# Altium schematic sheet 2.4G_Telecontrol_Board_2020-04-17_STM32RBT6.schdoc
size 408 x 508 mm
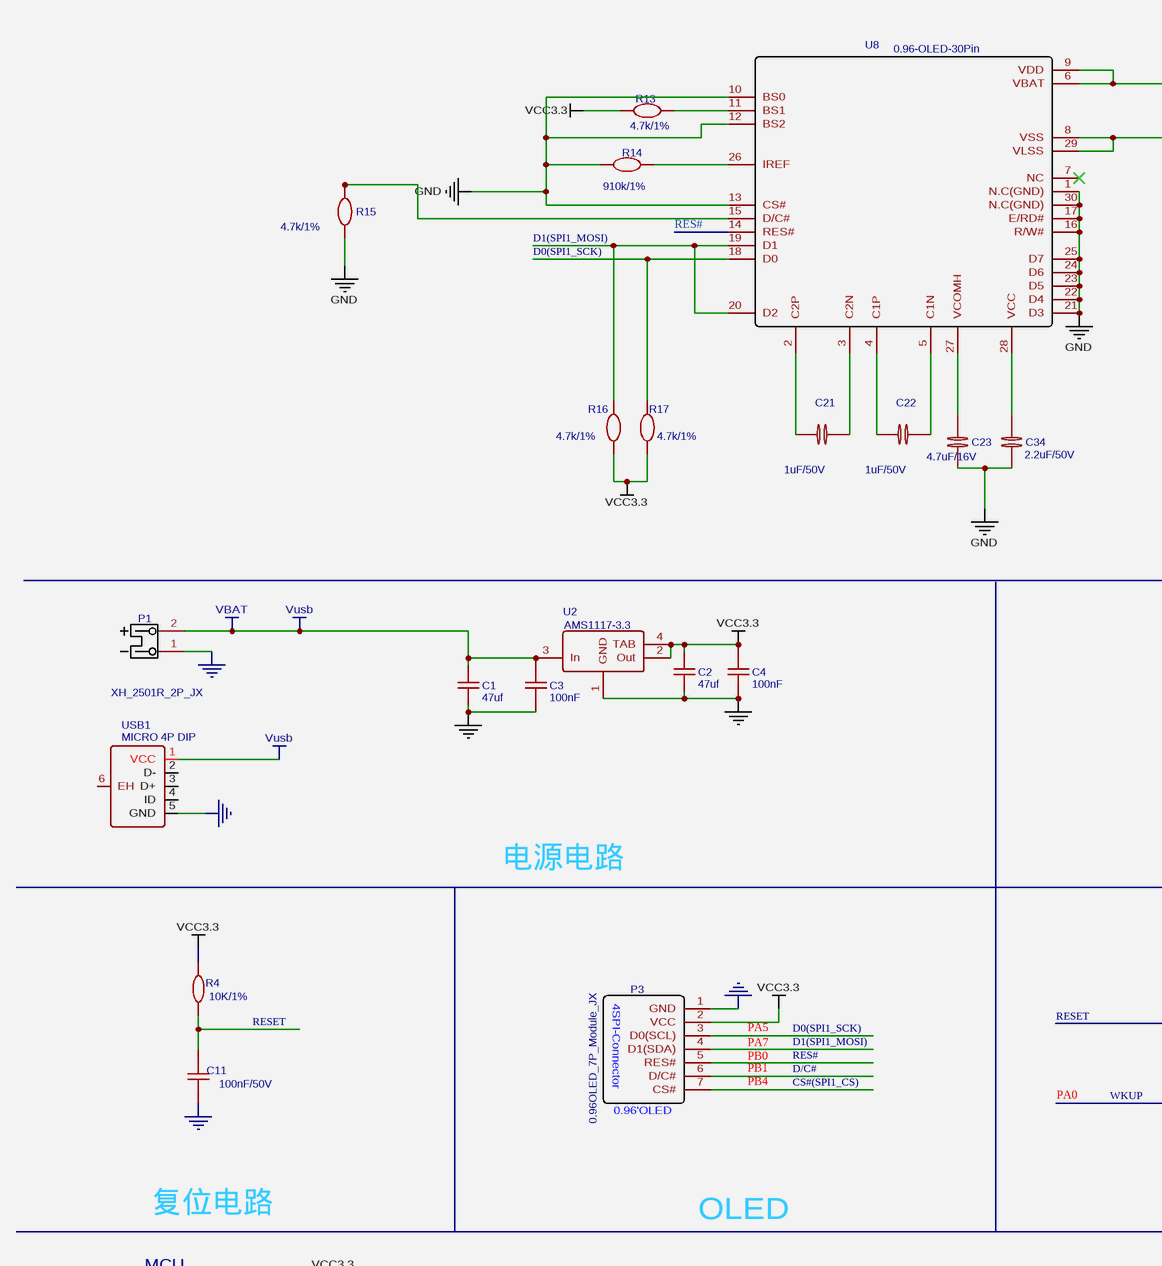
[diagram p0: 2.4G_Telecontrol_Board_2020-04-17_STM32RBT6.schdoc, top left]
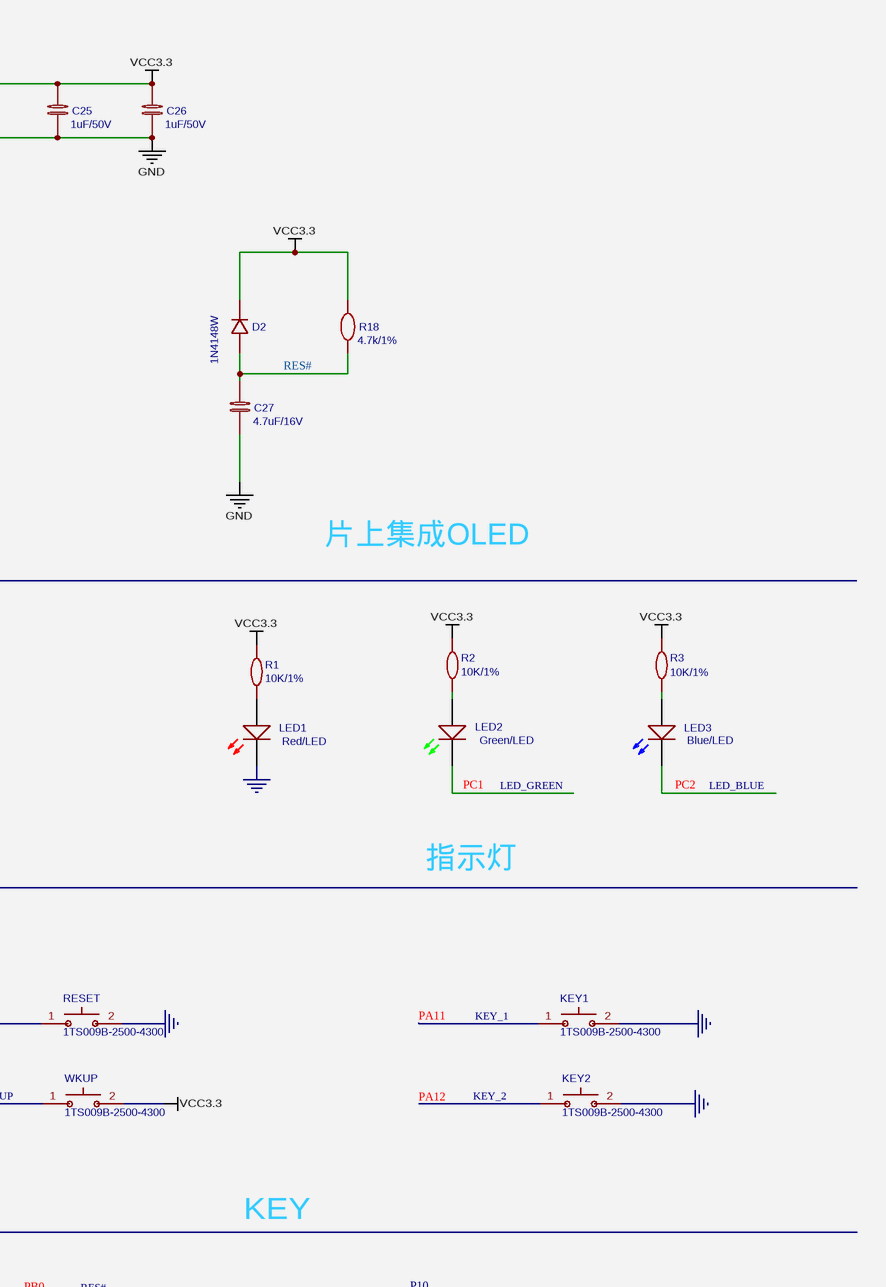
[diagram p1: 2.4G_Telecontrol_Board_2020-04-17_STM32RBT6.schdoc, top right]
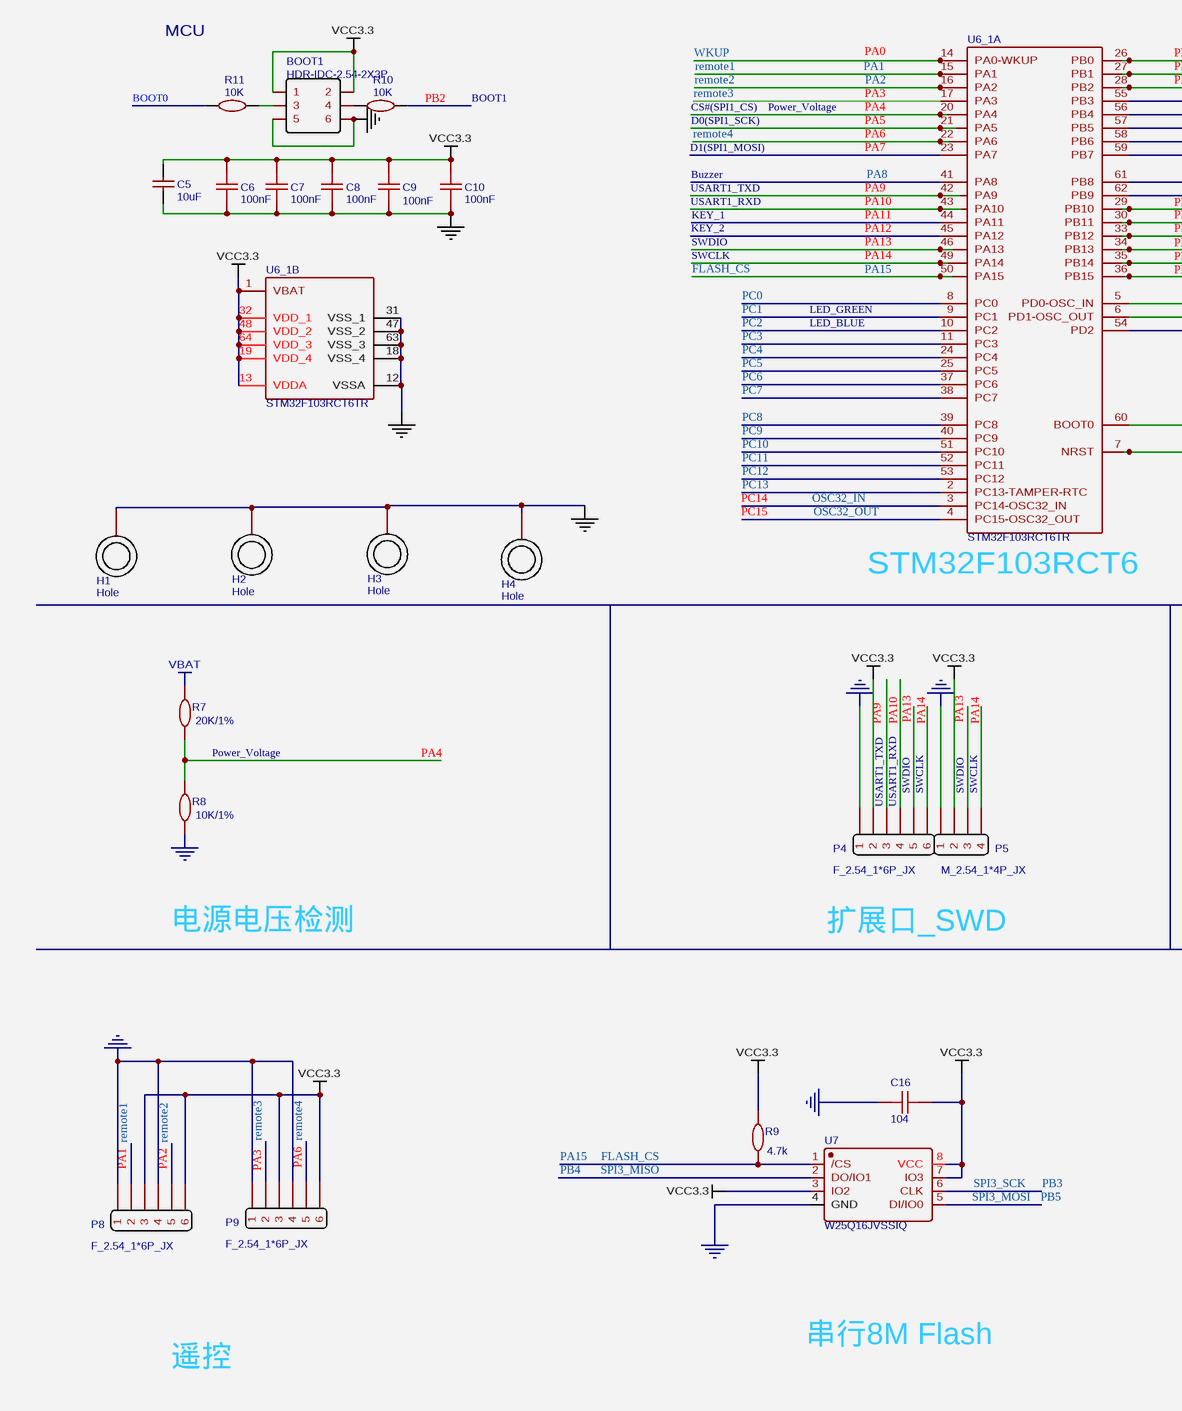
[diagram p2: 2.4G_Telecontrol_Board_2020-04-17_STM32RBT6.schdoc, bottom left]
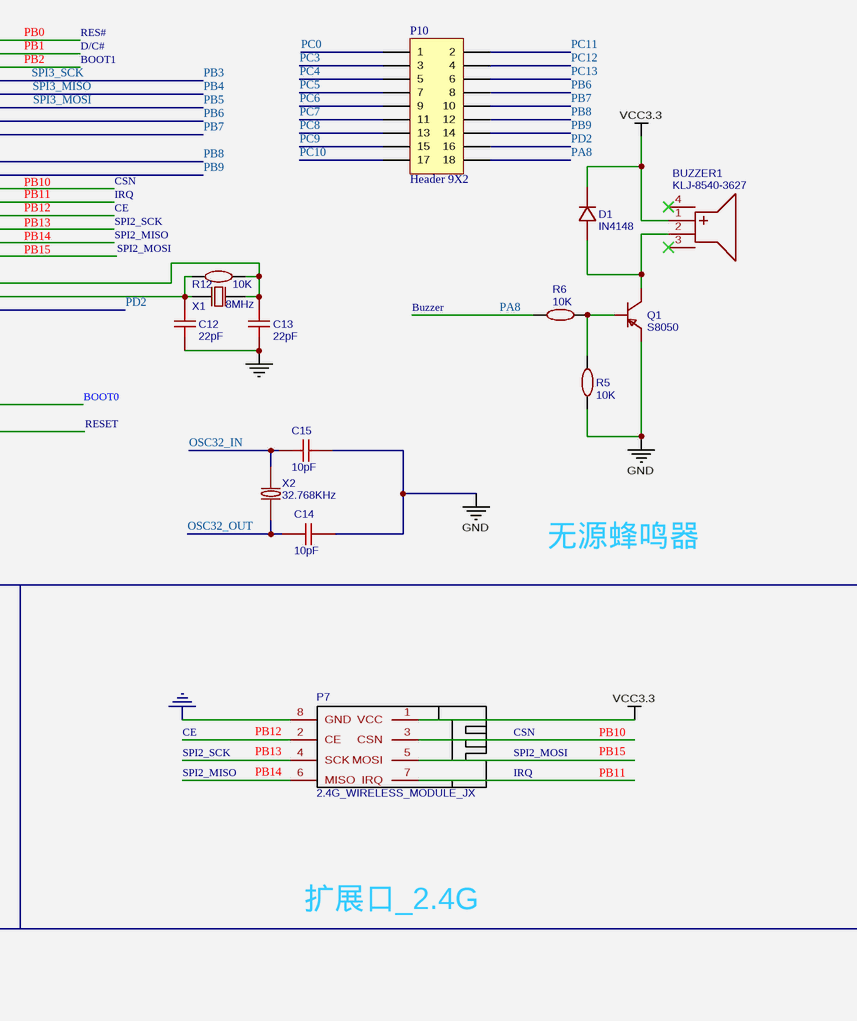
[diagram p3: 2.4G_Telecontrol_Board_2020-04-17_STM32RBT6.schdoc, bottom right]

## Parts
BOOT1  HDR-IDC-2.54-2X3P  [A2541WV-2X3P]
BUZZER1  KLJ-8540-3627  [BUZ-SMD_4P-L8.5-W8.5-TL]
C1  47uf  [0603]
C2  47uf  [0603]
C3  100nF  [0603]
C4  100nF  [0603]
C5  10uF  [0805]
C6  100nF  [0603]
C7  100nF  [0603]
C8  100nF  [0603]
C9  100nF  [0603]
C10  100nF  [0603]
C11  100nF/50V  [0603_C_JX]
C12  22pF  [0603]
C13  22pF  [0603]
C14  10pF  [0603]
C15  10pF  [0603]
C16  104  [0603]
C21  1uF/50V  [0603_C_JX]
C22  1uF/50V  [0603_C_JX]
C23  4.7uF/16V  [0603_C_JX]
C25  1uF/50V  [0603_C_JX]
C26  1uF/50V  [0603_C_JX]
C27  4.7uF/16V  [0603_C_JX]
C34  2.2uF/50V  [0603_C_JX]
D1  IN4148  [SOD-523_JX]
D2  1N4148W  [SOD-523_JX]
H1  Hole  [PCBComponent_1 - duplicate]
H2  Hole  [PCBComponent_1 - duplicate]
H3  Hole  [PCBComponent_1 - duplicate]
H4  Hole  [PCBComponent_1 - duplicate]
KEY1  1TS009B-2500-4300  [SW-SMD_L6.0-W6.0-P6.00-LS6.6]
KEY2  1TS009B-2500-4300  [SW-SMD_L6.0-W6.0-P6.00-LS6.6]
LED1  Red/LED  [0603_D_JX]
LED2  Green/LED  [0603_D_JX]
LED3  Blue/LED  [0603_D_JX]
P1  XH_2501R_2P_JX  [XH_2501R_2P_JX]
P3  0.96OLED_7P_Module_JX  [0.96OLED_7P_MODULE_JX]
P4  F_2.54_1*6P_JX  [M_2.54_1*6P_JX]
P5  M_2.54_1*4P_JX  [M_2.54_1*4P_JX]
P7  2.4G_WIRELESS_MODULE_JX  [WIRELM-SMD_DL-24N-2.4G]
P8  F_2.54_1*6P_JX  [M_2.54_1*6P_JX]
P9  F_2.54_1*6P_JX  [M_2.54_1*6P_JX]
P10  Header 9X2  [HDR2X9]
Q1  S8050  [SOT-23-3_L2.9-W1.3-P1.90-LS2.4-BR]
R1  10K/1%  [0603_R_JX]
R2  10K/1%  [0603_R_JX]
R3  10K/1%  [0603_R_JX]
R4  10K/1%  [0603_R_JX]
R5  10K  [0603]
R6  10K  [0603]
R7  20K/1%  [0603_R_JX]
R8  10K/1%  [0603_R_JX]
R9  4.7k  [0603_R_JX]
R10  10K  [0603]
R11  10K  [0603]
R12  10K  [0603]
R13  4.7k/1%  [0603_R_JX]
R14  910k/1%  [0603_R_JX]
R15  4.7k/1%  [0603_R_JX]
R16  4.7k/1%  [0603_R_JX]
R17  4.7k/1%  [0603_R_JX]
R18  4.7k/1%  [0603_R_JX]
RESET  1TS009B-2500-4300  [SW-SMD_L6.0-W6.0-P6.00-LS6.6]
U2  AMS1117-3.3  [SOT-223]
U6_1  STM32F103RCT6TR  [LQFP-64_10X10X05P]  (parts A,B of 2)
U7  W25Q16JVSSIQ  [w25q16]
U8  0.96-OLED-30Pin  [new_OLED30P]
USB1  MICRO 4P DIP  [MINI-USB-SMD_MICRO-4P-DIP]
WKUP  1TS009B-2500-4300  [SW-SMD_L6.0-W6.0-P6.00-LS6.6]
X1  8MHz  [SMD-5032_2P]
X2  32.768KHz  [32.768khz]

## Nets
GND: BOOT1.5 BOOT1.6 C1.1 C2.1 C3.1 C4.1 C5.1 C6.1 C7.1 C8.1 C9.1 C10.1 C11.1 C12.2 C13.2 C14.1 C15.1 C16.1 C23.1 C25.2 C26.2 C27.2 C34.1 H1.1 H2.1 H3.1 H4.1 KEY1.2 KEY2.2 LED1.2(C) P1.1 P3.1(GND) P4.1 P5.1 P7.8(GND) P8.1 P8.4 P9.1 P9.4 Q1.2(E) R5.1 R8.2 R14.1 R15.1 RESET.2 U2.1(GND) U6_1.12(VSSA) U6_1.18(VSS_4) U6_1.31(VSS_1) U6_1.47(VSS_2) U6_1.63(VSS_3) U7.4(GND) U8.1(N.C(GND)) U8.8(VSS) U8.10(BS0) U8.12(BS2) U8.13(CS#) U8.16(R/W#) U8.17(E/RD#) U8.21(D3) U8.22(D4) U8.23(D5) U8.24(D6) U8.25(D7) U8.29(VLSS) U8.30(N.C(GND)) USB1.5(GND)
VBAT: C1.2 C3.2 P1.2 R7.1 U2.3(In) USB1.1(VCC)  [also labelled Vusb]
VCC3.3: BOOT1.1 BOOT1.2 BUZZER1.1(+) C2.2 C4.2 C5.2 C6.2 C7.2 C8.2 C9.2 C10.2 C16.2 C25.1 C26.1 D1.1 D2.1(K) P3.2(VCC) P4.2 P5.2 P7.1(VCC) P8.3 P8.6 P9.3 P9.6 R1.2 R2.2 R3.2 R4.1 R9.1 R13.1 R16.1 R17.1 R18.2 U2.2(Out) U2.4(TAB) U6_1.1(VBAT) U6_1.13(VDDA) U6_1.19(VDD_4) U6_1.32(VDD_1) U6_1.48(VDD_2) U6_1.64(VDD_3) U7.3(IO2) U7.7(IO3) U7.8(VCC) U8.6(VBAT) U8.9(VDD) WKUP.2
BOOT0: R11.2 U6_1.60(BOOT0)
BOOT1: R10.1 U6_1.28(PB2)
Buzzer: P10.18 R6.2 U6_1.41(PA8)  [also labelled PA8]
CE: P7.2(CE) U6_1.33(PB12)
CS#(SPI1_CS): P3.7(CS#) R7.2 R8.1 U6_1.20(PA4)  [also labelled Power_Voltage]
CSN: P7.3(CSN) U6_1.29(PB10)
D0(SPI1_SCK): P3.3(D0(SCL)) R17.2 U6_1.21(PA5) U8.18(D0)
D1(SPI1_MOSI): P3.4(D1(SDA)) R16.2 U6_1.23(PA7) U8.19(D1) U8.20(D2)
D/C#: P3.6(D/C#) U6_1.27(PB1)
FLASH_CS: R9.2 U6_1.50(PA15) U7.1(/CS)  [also labelled PA15]
IRQ: P7.7(IRQ) U6_1.30(PB11)
KEY_1: KEY1.1 U6_1.44(PA11)
KEY_2: KEY2.1 U6_1.45(PA12)
LED_BLUE: LED3.2(C) U6_1.10(PC2)  [also labelled PC2]
LED_GREEN: LED2.2(C) U6_1.9(PC1)  [also labelled PC1]
OSC32_IN: C15.2 U6_1.3(PC14-OSC32_IN) X2.1
OSC32_OUT: C14.2 U6_1.4(PC15-OSC32_OUT) X2.2
PA1: P8.2 U6_1.15(PA1)  [also labelled remote1]
PA2: P8.5 U6_1.16(PA2)  [also labelled remote2]
PB3: U6_1.55(PB3) U7.6(CLK)  [also labelled SPI3_SCK]
PB4: U6_1.56(PB4) U7.2(DO/IO1)  [also labelled SPI3_MISO]
PB5: U6_1.57(PB5) U7.5(DI/IO0)  [also labelled SPI3_MOSI]
PB6: P10.8 U6_1.58(PB6)
PB7: P10.10 U6_1.59(PB7)
PB8: P10.12 U6_1.61(PB8)
PB9: P10.14 U6_1.62(PB9)
PC0: P10.1 U6_1.8(PC0)
PC3: P10.3 U6_1.11(PC3)
PC4: P10.5 U6_1.24(PC4)
PC5: P10.7 U6_1.25(PC5)
PC6: P10.9 U6_1.37(PC6)
PC7: P10.11 U6_1.38(PC7)
PC8: P10.13 U6_1.39(PC8)
PC9: P10.15 U6_1.40(PC9)
PC10: P10.17 U6_1.51(PC10)
PC11: P10.2 U6_1.52(PC11)
PC12: P10.4 U6_1.53(PC12)
PC13: P10.6 U6_1.2(PC13-TAMPER-RTC)
PD2: P10.16 U6_1.54(PD2)
remote3: P9.2 U6_1.17(PA3)
remote4: P9.5 U6_1.22(PA6)
RES#: C27.1 D2.2(A) P3.5(RES#) R18.1 U6_1.26(PB0) U8.14(RES#)
RESET: C11.2 R4.2 RESET.1 U6_1.7(NRST)
SPI2_MISO: P7.6(MISO) U6_1.35(PB14)
SPI2_MOSI: P7.5(MOSI) U6_1.36(PB15)
SPI2_SCK: P7.4(SCK) U6_1.34(PB13)
SWCLK: P4.6 P5.4 U6_1.49(PA14)
SWDIO: P4.5 P5.3 U6_1.46(PA13)
USART1_RXD: P4.4 U6_1.43(PA10)
USART1_TXD: P4.3 U6_1.42(PA9)
WKUP: U6_1.14(PA0-WKUP) WKUP.1
NetBOOT1_3: BOOT1.3 R11.1
NetBOOT1_4: BOOT1.4 R10.2
NetBUZZER1_2: BUZZER1.2(-) D1.2 Q1.3(C)
NetC12_1: C12.1 R12.2 U6_1.6(PD1-OSC_OUT) X1.2(OSC2)
NetC13_1: C13.1 R12.1 U6_1.5(PD0-OSC_IN) X1.1(OSC1)
NetC21_1: C21.1 U8.2(C2P)
NetC21_2: C21.2 U8.3(C2N)
NetC22_1: C22.1 U8.4(C1P)
NetC22_2: C22.2 U8.5(C1N)
NetC23_2: C23.2 U8.27(VCOMH)
NetC34_2: C34.2 U8.28(VCC)
NetLED1_1: LED1.1(A) R1.1
NetLED2_1: LED2.1(A) R2.1
NetLED3_1: LED3.1(A) R3.1
NetQ1_1: Q1.1(B) R5.2 R6.1
NetR13_2: R13.2 U8.11(BS1)
NetR14_2: R14.2 U8.26(IREF)
NetR15_2: R15.2 U8.15(D/C#)

Not connected (* = marked no-connect by the designer): BUZZER1 3* 4*; U8 7(NC)*; USB1 2(D-) 3(D+) 4(ID) 6(EH)

## Notes on the sheet
- 片上集成OLED
- (near LED2) PC1
- (near LED3) PC2
- 电源电路
- 指示灯
- PA11
- PB4
- PA5
- PA7
- PB0
- PB1
- PA0
- PA12
- 复位电路
- OLED
- KEY
- MCU
- (near R10) PB2
- PA3
- PA4
- PB2
- PA9
- PA6
- PA10
- PA13
- PA14
- PB10
- PB11
- PB12
- PB13
- PB14
- PB15
- PC14
- PC15
- (near U6_1) STM32F103RCT6
- 无源蜂鸣器
- (near P7) PB12
- (near P7) PB13
- (near P7) PB14
- 电源电压检测
- 扩展口_SWD
- 扩展口_2.4G
- (near P8) PA1
- (near P8) PA2
- (near P9) PA3
- (near P9) PA6
- 遥控
- 串行8M Flash
- (in symbol 0.96OLED_7P_Module_JX) 4SPI-Connector; 0.96'OLED

## Library data of the parts
BOOT1 = HDR-IDC-2.54-2X3P: BOM_Manufacturer: BOOMELE; BOM_Manufacturer Part: 2X3 2.54mm IDC Box; BOM_Supplier: LCSC; image: //image.lceda.cn/szlcsc/C11214.jpg; BOM_Supplier Part: C11214; spicePre: P
BUZZER1 = KLJ-8540-3627: BOM_Manufacturer: KELIKING; Contributor: LCSC; BOM_Supplier: LCSC; BOM_Supplier Part: C189207; BOM_Manufacturer Part: KLJ-8540-3627; spicePre: B; spiceSymbolName: KLJ-8540-3627
C1-C4 C6-C10 = 100nF: BOM_Manufacturer: WTC; BOM_Manufacturer Part: 0603B104K500; nameAlias: Capacitance; BOM_Supplier: LCSC; BOM_Supplier Part: C90807; spicePre: C; spiceSymbolName: 0603B104K500
C5 = 10uF: BOM_Manufacturer: FH; BOM_Manufacturer Part: 0805F106M250NT; nameAlias: Capacitance; BOM_Supplier: LCSC; BOM_Supplier Part: C48181; spicePre: C; spiceSymbolName: 0805F106M250NT
C11 = 100nF/50V: nameAlias: Value(F); spicePre: C; spiceSymbolName: Capacitor; BOM_Supplier: LCSC
C12-C16 = 22pF: BOM_Manufacturer: WTC; BOM_Manufacturer Part: 0603N220G500; nameAlias: Capacitance; Contributor: LCSC; BOM_Supplier: LCSC; BOM_Supplier Part: C152916; spicePre: C; spiceSymbolName: 0603N220G500
C21 C22 C25 C26 = 1uF/50V: nameAlias: Value(F); spicePre: C; spiceSymbolName: Cap_RAD-0.1_EU
C23 C27 = 4.7uF/16V: nameAlias: Value(F); spicePre: C; spiceSymbolName: Cap_RAD-0.1_EU
C34 = 2.2uF/50V: nameAlias: Value(F); spicePre: C; spiceSymbolName: Cap_RAD-0.1_EU
D1 = IN4148: BOM_Manufacturer: Semtech; Contributor: LCSC; BOM_Supplier: LCSC; BOM_Supplier Part: C14538; BOM_Manufacturer Part: IN4148; spicePre: D; spiceSymbolName: IN4148
D2 = 1N4148W: BOM_Manufacturer: SEMTECH; SMT Type: Basic; BOM_Supplier: LCSC; BOM_Manufacturer Part: 1N4148W; image: //image.lceda.cn/szlcsc/C81598.jpg; BOM_Supplier Part: C81598; BOM_LCSC Assembly: Yes; spicePre: D
H1-H4 = Hole: Contributor: lc_ms; spicePre: H; spiceSymbolName: Hole
KEY1 KEY2 RESET WKUP = 1TS009B-2500-4300: BOM_Manufacturer: HYP; Contributor: LCSC; BOM_Supplier: LCSC; BOM_Supplier Part: C255815; BOM_Manufacturer Part: 1TS009B-2500-4300; spicePre: S; spiceSymbolName: 1TS009B-2500-4300
P1 = XH_2501R_2P_JX: catid: 20; BOM_Supplier: LCSC; spicePre: P
P7 = 2.4G_WIRELESS_MODULE_JX: sourceId: LXR9rJ0Uc; timeStamp: 1459465771; BOM_Supplier: 技小新; spicePre: P
P10 = Header 9X2: Header, 9-Pin, Dual row; LatestRevisionDate: 17-Jul-2002; LatestRevisionNote: Re-released for DXP Platform.; Publisher: Altium Limited
Q1 = S8550_C2147: BOM_Manufacturer: CJ; BOM_Manufacturer Part: S8550; SMT Type: Extend; BOM_Supplier: LCSC; image: //image.lceda.cn/szlcsc/C2147.jpg; BOM_Supplier Part: C2147; BOM_LCSC Assembly: Yes; spicePre: Q; spiceSymbolName: S8550_C2147
R1-R4 R8 R9 = 10K/1%: nameAlias: Value(Ω); spicePre: R; spiceSymbolName: Resistor; BOM_Supplier: LCSC
R5 R6 R10-R12 = 10K: BOM_Manufacturer: ROHM; BOM_Manufacturer Part: MCR03EZPFX1002; nameAlias: Resistance (Ohms); BOM_Supplier: LCSC; BOM_Supplier Part: C114853; spicePre: R; spiceSymbolName: MCR03EZPFX1002
R7 = 20K/1%: nameAlias: Value(Ω); spicePre: R; spiceSymbolName: Resistor; BOM_Supplier: LCSC
R13 R15-R18 = 4.7k/1%: nameAlias: Value(Ω); spicePre: R; spiceSymbolName: Res_AXIAL-0.3(1/8W)_EU
R14 = 910k/1%: nameAlias: Value(Ω); spicePre: R; spiceSymbolName: Res_AXIAL-0.3(1/8W)_EU
U2 = AMS1117-3.3: BOM_Manufacturer: AMS; sourceId: dwIGgezVh; timeStamp: 1476261164; BOM_Supplier: LCSC; BOM_Manufacturer Part: AMS1117-3.3; BOM_LCSC Assembly: Yes; image: //image.lceda.cn/szlcsc/C6186.jpg; BOM_Supplier Part: C6186; spicePre: U
U6_1 = STM32F103RCT6TR_1: BOM_Manufacturer: STMicroelectronics; BOM_Supplier: LCSC; BOM_Manufacturer Part: STM32F103RCT6TR; image: //image.lceda.cn/szlcsc/C39704.jpg; BOM_Supplier Part: C39704; BOM_LCSC Assembly: Yes; spicePre: U
U7 = W25Q16JVSSIQ: BOM_Manufacturer: WINBOND; SMT Type: Extend; BOM_Supplier: LCSC; BOM_Manufacturer Part: W25Q16JVSSIQ; image: //image.lceda.cn/szlcsc/C82317.jpg; BOM_Supplier Part: C82317; BOM_LCSC Assembly: Yes; spicePre: U; spiceSymbolName: W25Q16JVSSIQ
U8 = 0.96-OLED-30Pin_JX-周利杰: Contributor: 2019电子技术新讲座; spicePre: U
USB1 = MICRO 4P DIP: BOM_Manufacturer: SHOU HAN; Contributor: LCSC; BOM_Supplier: LCSC; BOM_Supplier Part: C456008; BOM_Manufacturer Part: MICRO 4P DIP; spicePre: U; spiceSymbolName: MICRO 4P DIP
X1 = 8MHz: BOM_Manufacturer: TXC Corp; BOM_Manufacturer Part: AA08000004; nameAlias: Value; Contributor: LCSC; BOM_Supplier: LCSC; BOM_Supplier Part: C337214; spicePre: X; spiceSymbolName: AA08000004
X2 = 32.768KHz: BOM_Manufacturer: EPSON; BOM_Manufacturer Part: FC-135R32.768kHz7.0pF20PPM; nameAlias: Frequency; BOM_Supplier: LCSC; BOM_Supplier Part: C94674; spicePre: X; spiceSymbolName: FC-135R32.768kHz7.0pF20PPM
LED1 = Red/LED: BOM_Supplier: LCSC; spicePre: L
LED2 = Green/LED: BOM_Supplier: LCSC; spicePre: L
LED3 = Blue/LED: BOM_Supplier: LCSC; spicePre: L
P3 = 0.96OLED_7P_Module_JX: spicePre: P; BOM_Supplier: 技小新
P4 P8 P9 = F_2.54_1*6P_JX: BOM_Supplier: LCSC; spicePre: P
P5 = M_2.54_1*4P_JX: BOM_Supplier: LCSC; spicePre: P